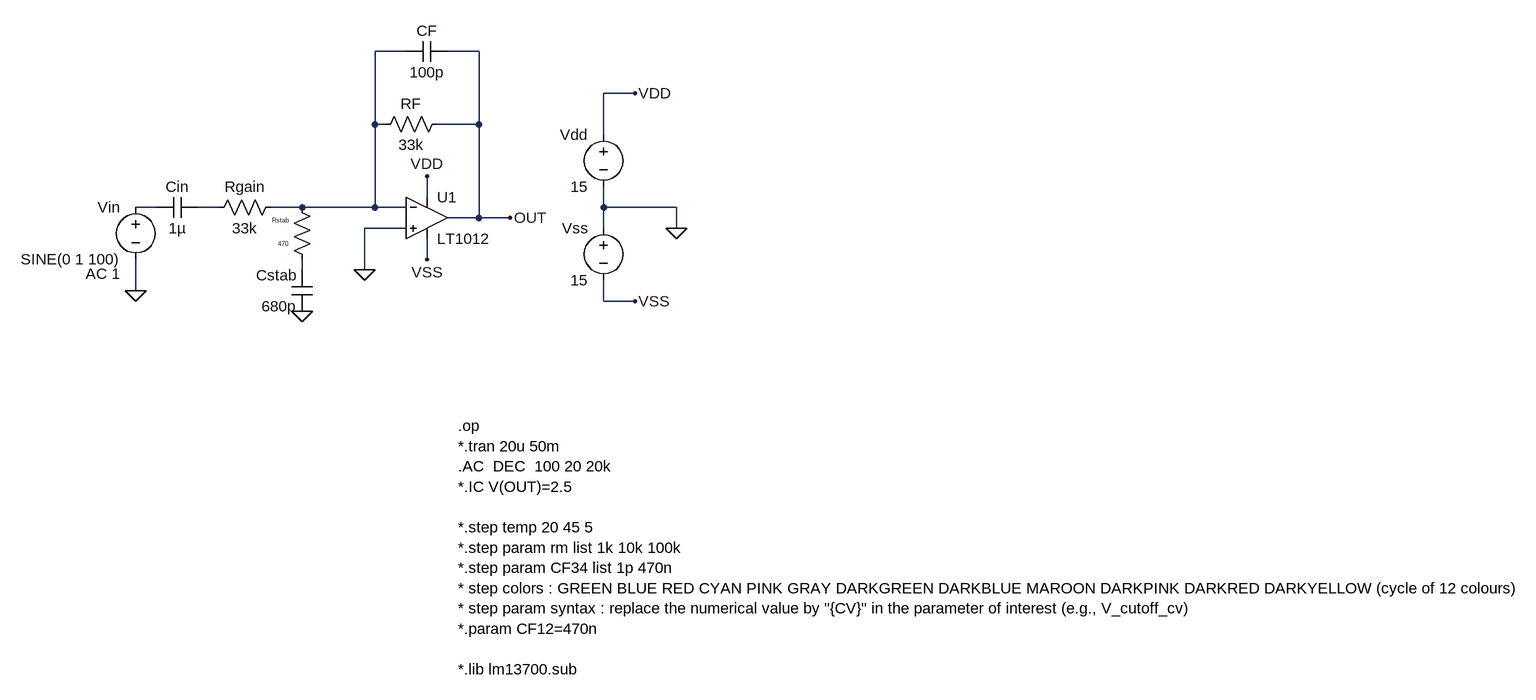
[diagram p0: schematic SSM2164.asc]
SSM2164.asc, the LTspice schematic file:
Version 4
SHEET 1 1716 1712
WIRE -912 -80 -960 -80
WIRE -800 -80 -848 -80
WIRE -560 -16 -608 -16
WIRE -960 32 -960 -80
WIRE -944 32 -960 32
WIRE -800 32 -800 -80
WIRE -800 32 -864 32
WIRE -608 48 -608 -16
WIRE -880 144 -880 112
WIRE -1296 160 -1328 160
WIRE -1200 160 -1232 160
WIRE -1072 160 -1120 160
WIRE -960 160 -960 32
WIRE -960 160 -1072 160
WIRE -912 160 -960 160
WIRE -608 160 -608 128
WIRE -496 160 -608 160
WIRE -800 176 -800 32
WIRE -800 176 -848 176
WIRE -752 176 -800 176
WIRE -912 192 -976 192
WIRE -608 192 -608 160
WIRE -496 192 -496 160
WIRE -880 240 -880 208
WIRE -1072 256 -1072 240
WIRE -976 256 -976 192
WIRE -1328 288 -1328 240
WIRE -608 304 -608 272
WIRE -560 304 -608 304
FLAG -976 256 0
FLAG -496 192 0
FLAG -752 176 OUT
FLAG -560 -16 VDD
FLAG -560 304 VSS
FLAG -880 112 VDD
FLAG -880 240 VSS
FLAG -1328 288 0
FLAG -1072 320 0
DATAFLAG -800 -80 "$"
DATAFLAG -800 -80 "$"
SYMBOL Opamps/LT1012 -880 112 R0
SYMATTR InstName U1
SYMBOL voltage -608 176 M0
WINDOW 123 0 0 Left 2
WINDOW 39 0 0 Left 2
SYMATTR InstName Vss
SYMATTR Value 15
SYMBOL voltage -608 32 M0
WINDOW 123 0 0 Left 2
WINDOW 39 0 0 Left 2
SYMATTR InstName Vdd
SYMATTR Value 15
SYMBOL res -848 16 R90
WINDOW 0 0 56 VBottom 2
WINDOW 3 32 56 VTop 2
SYMATTR InstName RF
SYMATTR Value 33k
SYMBOL cap -848 -96 R90
WINDOW 0 0 32 VBottom 2
WINDOW 3 32 32 VTop 2
SYMATTR InstName CF
SYMATTR Value 100p
SYMBOL voltage -1328 144 M0
WINDOW 123 24 118 Left 2
WINDOW 39 0 0 Left 2
SYMATTR Value2 AC 1
SYMATTR InstName Vin
SYMATTR Value SINE(0 1 100)
SYMBOL res -1056 256 R180
WINDOW 0 36 76 Left 0
WINDOW 3 36 40 Left 0
SYMATTR InstName Rstab
SYMATTR Value 470
SYMBOL cap -1056 320 R180
WINDOW 0 24 56 Left 2
WINDOW 3 24 8 Left 2
SYMATTR InstName Cstab
SYMATTR Value 680p
SYMBOL res -1104 144 R90
WINDOW 0 0 56 VBottom 2
WINDOW 3 32 56 VTop 2
SYMATTR InstName Rgain
SYMATTR Value 33k
SYMBOL cap -1232 144 R90
WINDOW 0 0 32 VBottom 2
WINDOW 3 32 32 VTop 2
SYMATTR InstName Cin
SYMATTR Value 1µ
TEXT -832 496 Left 2 !.op\n*.tran 20u 50m\n.AC  DEC  100 20 20k\n*.IC V(OUT)=2.5\n\n*.step temp 20 45 5\n*.step param rm list 1k 10k 100k\n*.step param CF34 list 1p 470n\n* step colors : GREEN BLUE RED CYAN PINK GRAY DARKGREEN DARKBLUE MAROON DARKPINK DARKRED DARKYELLOW (cycle of 12 colours)\n* step param syntax : replace the numerical value by "{CV}" in the parameter of interest (e.g., V_cutoff_cv)\n*.param CF12=470n\n\n*.lib lm13700.sub

The netlist it stands for:
* SSM2164.asc
XU1 0 N001 VDD VSS OUT LT1012  ; pins In+ In- V+ V- OUT
Vss 0 VSS 15
Vdd VDD 0 15
RF OUT N001 33k
CF OUT N001 100p
Vin N002 0 SINE(0 1 100) AC 1
Rstab N004 N001 470
Cstab 0 N004 680p
Rgain N001 N003 33k
Cin N003 N002 1µ
.op
*.tran 20u 50m
.AC  DEC  100 20 20k
*.IC V(OUT)=2.5
*.step temp 20 45 5
*.step param rm list 1k 10k 100k
*.step param CF34 list 1p 470n
* step colors : GREEN BLUE RED CYAN PINK GRAY DARKGREEN DARKBLUE MAROON DARKPINK DARKRED DARKYELLOW (cycle of 12 colours)
* step param syntax : replace the numerical value by "{CV}" in the parameter of interest (e.g., V_cutoff_cv)
*.param CF12=470n
*.lib lm13700.sub
.backanno
.end